# Altium schematic sheet Tracking-Car.SchDoc
size 406 x 266 mm; SheetNumber: 1; SheetTotal: 1
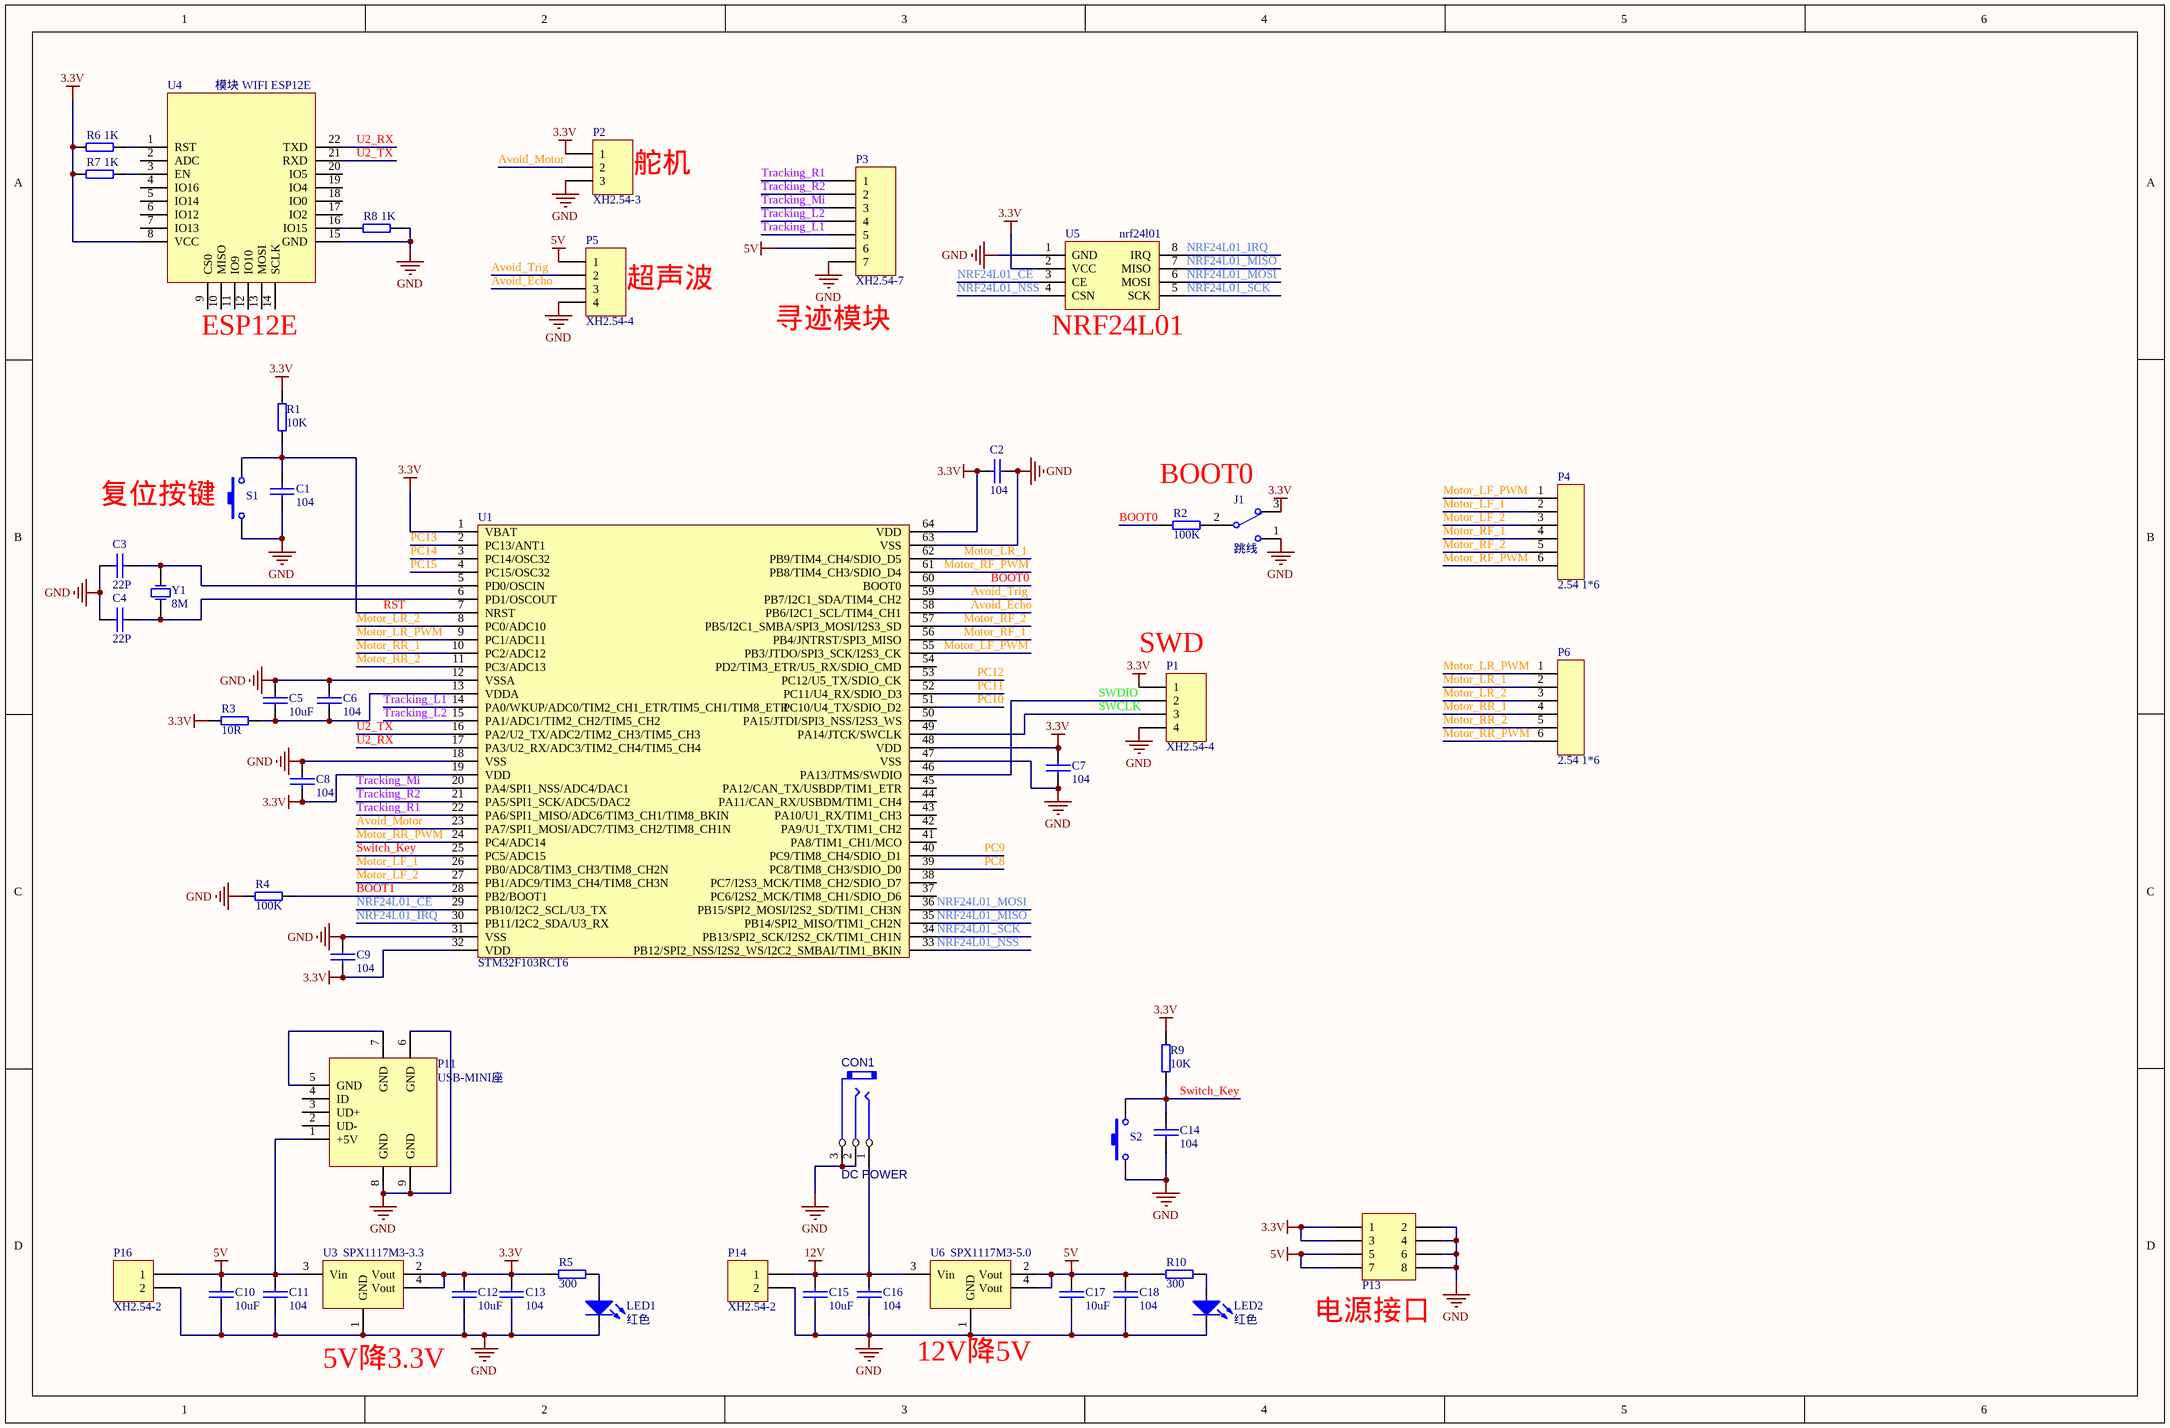
[diagram p0: Tracking-Car.SchDoc]

## Parts
C1  104  [0805]
C2  104  [0805]
C3  22P  [0805]
C4  22P  [0805]
C5  10uF  [0805]
C6  104  [0805]
C7  104  [0805]
C8  104  [0805]
C9  104  [0805]
C10  10uF  [0805]
C11  104  [0805]
C12  10uF  [0805]
C13  104  [0805]
C14  104  [0805]
C15  10uF  [0805]
C16  104  [0805]
C17  10uF  [0805]
C18  104  [0805]
CON1  DC POWER  [Power  2.1mm]
J1  跳线  [单排插针 2.54 1*3]
LED1  红色  [LED0805]
LED2  红色  [LED0805]
P1  XH2.54-4  [VH2.54_4]
P2  XH2.54-3  [单排插针 2.54 1*3]
P3  XH2.54-7  [VH2.54_7]
P4  2.54 1*6  [单排插针 2.54 1*6]
P5  XH2.54-4  [VH2.54_4]
P6  2.54 1*6  [单排插针 2.54 1*6]
P11  USB-MINI座  [USB MINI DIP]
P13  双排插针 2.54 2*4  [双排插针 2.54 2*4]  (value not drawn)
P14  XH2.54-2  [VH2.54_2]
P16  XH2.54-2  [VH2.54_2]
R1  10K  [0805]
R2  100K  [0805]
R3  10R  [0805]
R4  100K  [0805]
R5  300  [0805]
R6  1K  [0805]
R7  1K  [0805]
R8  1K  [0805]
R9  10K  [0805]
R10  300  [0805]
S1  key  [按键 轻触  6*3]  (value not drawn)
S2  key  [按键 轻触  6*3]  (value not drawn)
U1  STM32F103RCT6  [LQFP64]
U3  SPX1117M3-3.3  [SOT223]
U4  模块 WIFI ESP12E  [模块 WIFI ESP12E]
U5  nrf24l01  [模块 NRF24L01]
U6  SPX1117M3-5.0  [SOT223]
Y1  8M  [晶振 BCY-W2/E4.7]

## Nets
3.3V: C2.2 C7.1 C8.1 C9.1 C12.2 C13.2 J1.3 P1.1 P2.1 P13.1 P13.3 R1.1 R3.2 R5.2 R6.2 R7.2 R9.1 U1.1(VBAT) U1.19(VDD) U1.32(VDD) U1.48(VDD) U1.64(VDD) U3.2(Vout) U3.4(Vout) U4.8(VCC) U5.2(VCC)
5V: C10.2 C11.2 C17.2 C18.2 P3.6 P5.1 P11.1(+5V) P13.5 P13.7 P16.1 R10.2 U3.3(Vin) U6.2(Vout) U6.4(Vout)
12V: C15.2 C16.2 CON1.1 P14.1 U6.3(Vin)
GND: C1.1 C2.1 C3.1 C4.1 C5.2 C6.2 C7.2 C8.2 C9.2 C10.1 C11.1 C12.1 C13.1 C14.1 C15.1 C16.1 C17.1 C18.1 CON1.2 CON1.3 J1.1 LED1.2(K) LED2.2(K) P1.4 P2.3 P3.7 P5.4 P11.6(GND) P11.8(GND) P11.9(GND) P13.2 P13.4 P13.6 P13.8 P14.2 P16.2 R4.2 R8.1 S1.1 S2.1 U1.12(VSSA) U1.18(VSS) U1.31(VSS) U1.47(VSS) U1.63(VSS) U3.1(GND) U4.15(GND) U5.1(GND) U6.1(GND)
Avoid_Echo: P5.3 U1.58(PB6/I2C1_SCL/TIM4_CH1)
Avoid_Motor: P2.2 U1.23(PA7/SPI1_MOSI/ADC7/TIM3_CH2/TIM8_CH1N)
Avoid_Trig: P5.2 U1.59(PB7/I2C1_SDA/TIM4_CH2)
BOOT0: R2.2 U1.60(BOOT0)
BOOT1: R4.1 U1.28(PB2/BOOT1)
Motor_LF_1: P4.2 U1.26(PB0/ADC8/TIM3_CH3/TIM8_CH2N)
Motor_LF_2: P4.3 U1.27(PB1/ADC9/TIM3_CH4/TIM8_CH3N)
Motor_LF_PWM: P4.1 U1.55(PB3/JTDO/SPI3_SCK/I2S3_CK)
Motor_LR_1: P6.2 U1.62(PB9/TIM4_CH4/SDIO_D5)
Motor_LR_2: P6.3 U1.8(PC0/ADC10)
Motor_LR_PWM: P6.1 U1.9(PC1/ADC11)
Motor_RF_1: P4.4 U1.56(PB4/JNTRST/SPI3_MISO)
Motor_RF_2: P4.5 U1.57(PB5/I2C1_SMBA/SPI3_MOSI/I2S3_SD)
Motor_RF_PWM: P4.6 U1.61(PB8/TIM4_CH3/SDIO_D4)
Motor_RR_1: P6.4 U1.10(PC2/ADC12)
Motor_RR_2: P6.5 U1.11(PC3/ADC13)
Motor_RR_PWM: P6.6 U1.24(PC4/ADC14)
NRF24L01_CE: U1.29(PB10/I2C2_SCL/U3_TX) U5.3(CE)
NRF24L01_IRQ: U1.30(PB11/I2C2_SDA/U3_RX) U5.8(IRQ)
NRF24L01_MISO: U1.35(PB14/SPI2_MISO/TIM1_CH2N) U5.7(MISO)
NRF24L01_MOSI: U1.36(PB15/SPI2_MOSI/I2S2_SD/TIM1_CH3N) U5.6(MOSI)
NRF24L01_NSS: U1.33(PB12/SPI2_NSS/I2S2_WS/I2C2_SMBAI/TIM1_BKIN) U5.4(CSN)
NRF24L01_SCK: U1.34(PB13/SPI2_SCK/I2S2_CK/TIM1_CH1N) U5.5(SCK)
PC8: U1.39(PC8/TIM8_CH3/SDIO_D0)
PC9: U1.40(PC9/TIM8_CH4/SDIO_D1)
PC10: U1.51(PC10/U4_TX/SDIO_D2)
PC11: U1.52(PC11/U4_RX/SDIO_D3)
PC12: U1.53(PC12/U5_TX/SDIO_CK)
PC13: U1.2(PC13/ANT1)
PC14: U1.3(PC14/OSC32)
PC15: U1.4(PC15/OSC32)
RST: C1.2 R1.2 S1.2 U1.7(NRST)
SWCLK: P1.3 U1.49(PA14/JTCK/SWCLK)
SWDIO: P1.2 U1.46(PA13/JTMS/SWDIO)
Switch_Key: C14.2 R9.2 S2.2 U1.25(PC5/ADC15)
Tracking_L1: P3.5 U1.14(PA0/WKUP/ADC0/TIM2_CH1_ETR/TIM5_CH1/TIM8_ETR)
Tracking_L2: P3.4 U1.15(PA1/ADC1/TIM2_CH2/TIM5_CH2)
Tracking_Mi: P3.3 U1.20(PA4/SPI1_NSS/ADC4/DAC1)
Tracking_R1: P3.1 U1.22(PA6/SPI1_MISO/ADC6/TIM3_CH1/TIM8_BKIN)
Tracking_R2: P3.2 U1.21(PA5/SPI1_SCK/ADC5/DAC2)
U2_RX: U1.17(PA3/U2_RX/ADC3/TIM2_CH4/TIM5_CH4) U4.22(TXD)
U2_TX: U1.16(PA2/U2_TX/ADC2/TIM2_CH3/TIM5_CH3) U4.21(RXD)
NetC3_2: C3.2 U1.5(PD0/OSCIN) Y1.2(OSC2)
NetC4_2: C4.2 U1.6(PD1/OSCOUT) Y1.1(OSC1)
NetC5_1: C5.1 C6.1 R3.1 U1.13(VDDA)
NetJ1_2: J1.2 R2.1
NetLED1_1: LED1.1(A) R5.1
NetLED2_1: LED2.1(A) R10.1
NetP11_5: P11.5(GND) P11.7(GND)
NetR6_1: R6.1 U4.1(RST)
NetR7_1: R7.1 U4.3(EN)
NetR8_2: R8.2 U4.16(IO15)

Not connected (* = marked no-connect by the designer): P11 2(UD-) 3(UD+) 4(ID); U1 37(PC6/I2S2_MCK/TIM8_CH1/SDIO_D6) 38(PC7/I2S3_MCK/TIM8_CH2/SDIO_D7) 41(PA8/TIM1_CH1/MCO) 42(PA9/U1_TX/TIM1_CH2) 43(PA10/U1_RX/TIM1_CH3) 44(PA11/CAN_RX/USBDM/TIM1_CH4) 45(PA12/CAN_TX/USBDP/TIM1_ETR) 50(PA15/JTDI/SPI3_NSS/I2S3_WS) 54(PD2/TIM3_ETR/U5_RX/SDIO_CMD); U4 2(ADC) 4(IO16) 5(IO14) 6(IO12) 7(IO13) 9(CS0) 10(MISO) 11(IO9) 12(IO10) 13(MOSI) 14(SCLK) 17(IO2) 18(IO0) 19(IO4) 20(IO5)

## Notes on the sheet
- (near P2) 舵机
- (near P5) 超声波
- (near U4) ESP12E
- (near P3) 寻迹模块
- (near U5) NRF24L01
- 复位按键
- BOOT0
- (near P1) SWD
- (near U3) 5V降3.3V
- (near U6) 12V降5V
- (near P13) 电源接口

## Library data of the parts
C1-C18 = 电容 贴片 0805: 名称: 贴片电容; 单位: 个; 封装: 0805
CON1 = 连接件 电源座
J1 = 联结件 跳线端子 2.54-3: 单位: 个; 封装: 直插; 名称: 跳线插针
LED1 LED2 = 二极管 贴片发光 0805: 名称: 贴片发光二极管; 封装: 0805; 单位: 个
P1 P5 = 联结件 XH2.54-4: 名称: 联结件; 单位: 套; 封装: XH2.54-4
P2 = 连接件 XH2.54-3: 名称: 连接件; 单位: 套; 封装: XH2.54-3
P3 = 连接件 XH2.54-7: 名称: 连接件; 单位: 套; 封装: XH2.54-7
P4 P6 = 连接件 单排插针 2.54 1*6: 单位: 片; 封装: DIP; 名称: 单排插针
P11 = 联结件 USB-MINI座: 单位: 个; 封装: 440068; 名称: 联结件
P13 = 联结件 双排插针 2.54 2*4: 名称: 联结件; 单位: 个; 封装: 直插
P14 P16 = 联结件 XH2.54-2: 名称: 联结件; 封装: VH3.96-2; 单位: 套
R1-R10 = 电阻 贴片 0805: 名称: 贴片电阻; 单位: 个; 封装: 0805
S1 S2 = 按键 轻触 3*6: 单位: 个; 名称: 开关; 封装: 直插 12*12*12
U1 = 贴片芯片 STM32F103RCT6: 单片机; 名称: 芯片; 单位: 片; 封装: LQFP64
U3 = 贴片芯片 SPX1117M3-3.3: LDO; 名称: 贴片芯片; 单位: 个; 封装: SOT223
U4 = 模块 WIFI ESP12E: 单位: 个; 封装: 表贴; 名称: WIFI模块
U5 = 模块 NRF24L01: 名称: 无线模块; 封装: DIP8; 单位: 个
U6 = 贴片芯片 SPX1117M3-5.0: LDO; 名称: 贴片芯片; 单位: 个; 封装: SOT223
Y1 = 晶振 直插矮: 名称: 晶振; 封装: 直插矮; 单位: 个